# EAGLE design IntegratedSensor (EAGLE 6.3)
Menlo Park Innovation LLC Sensor Front End Electronics
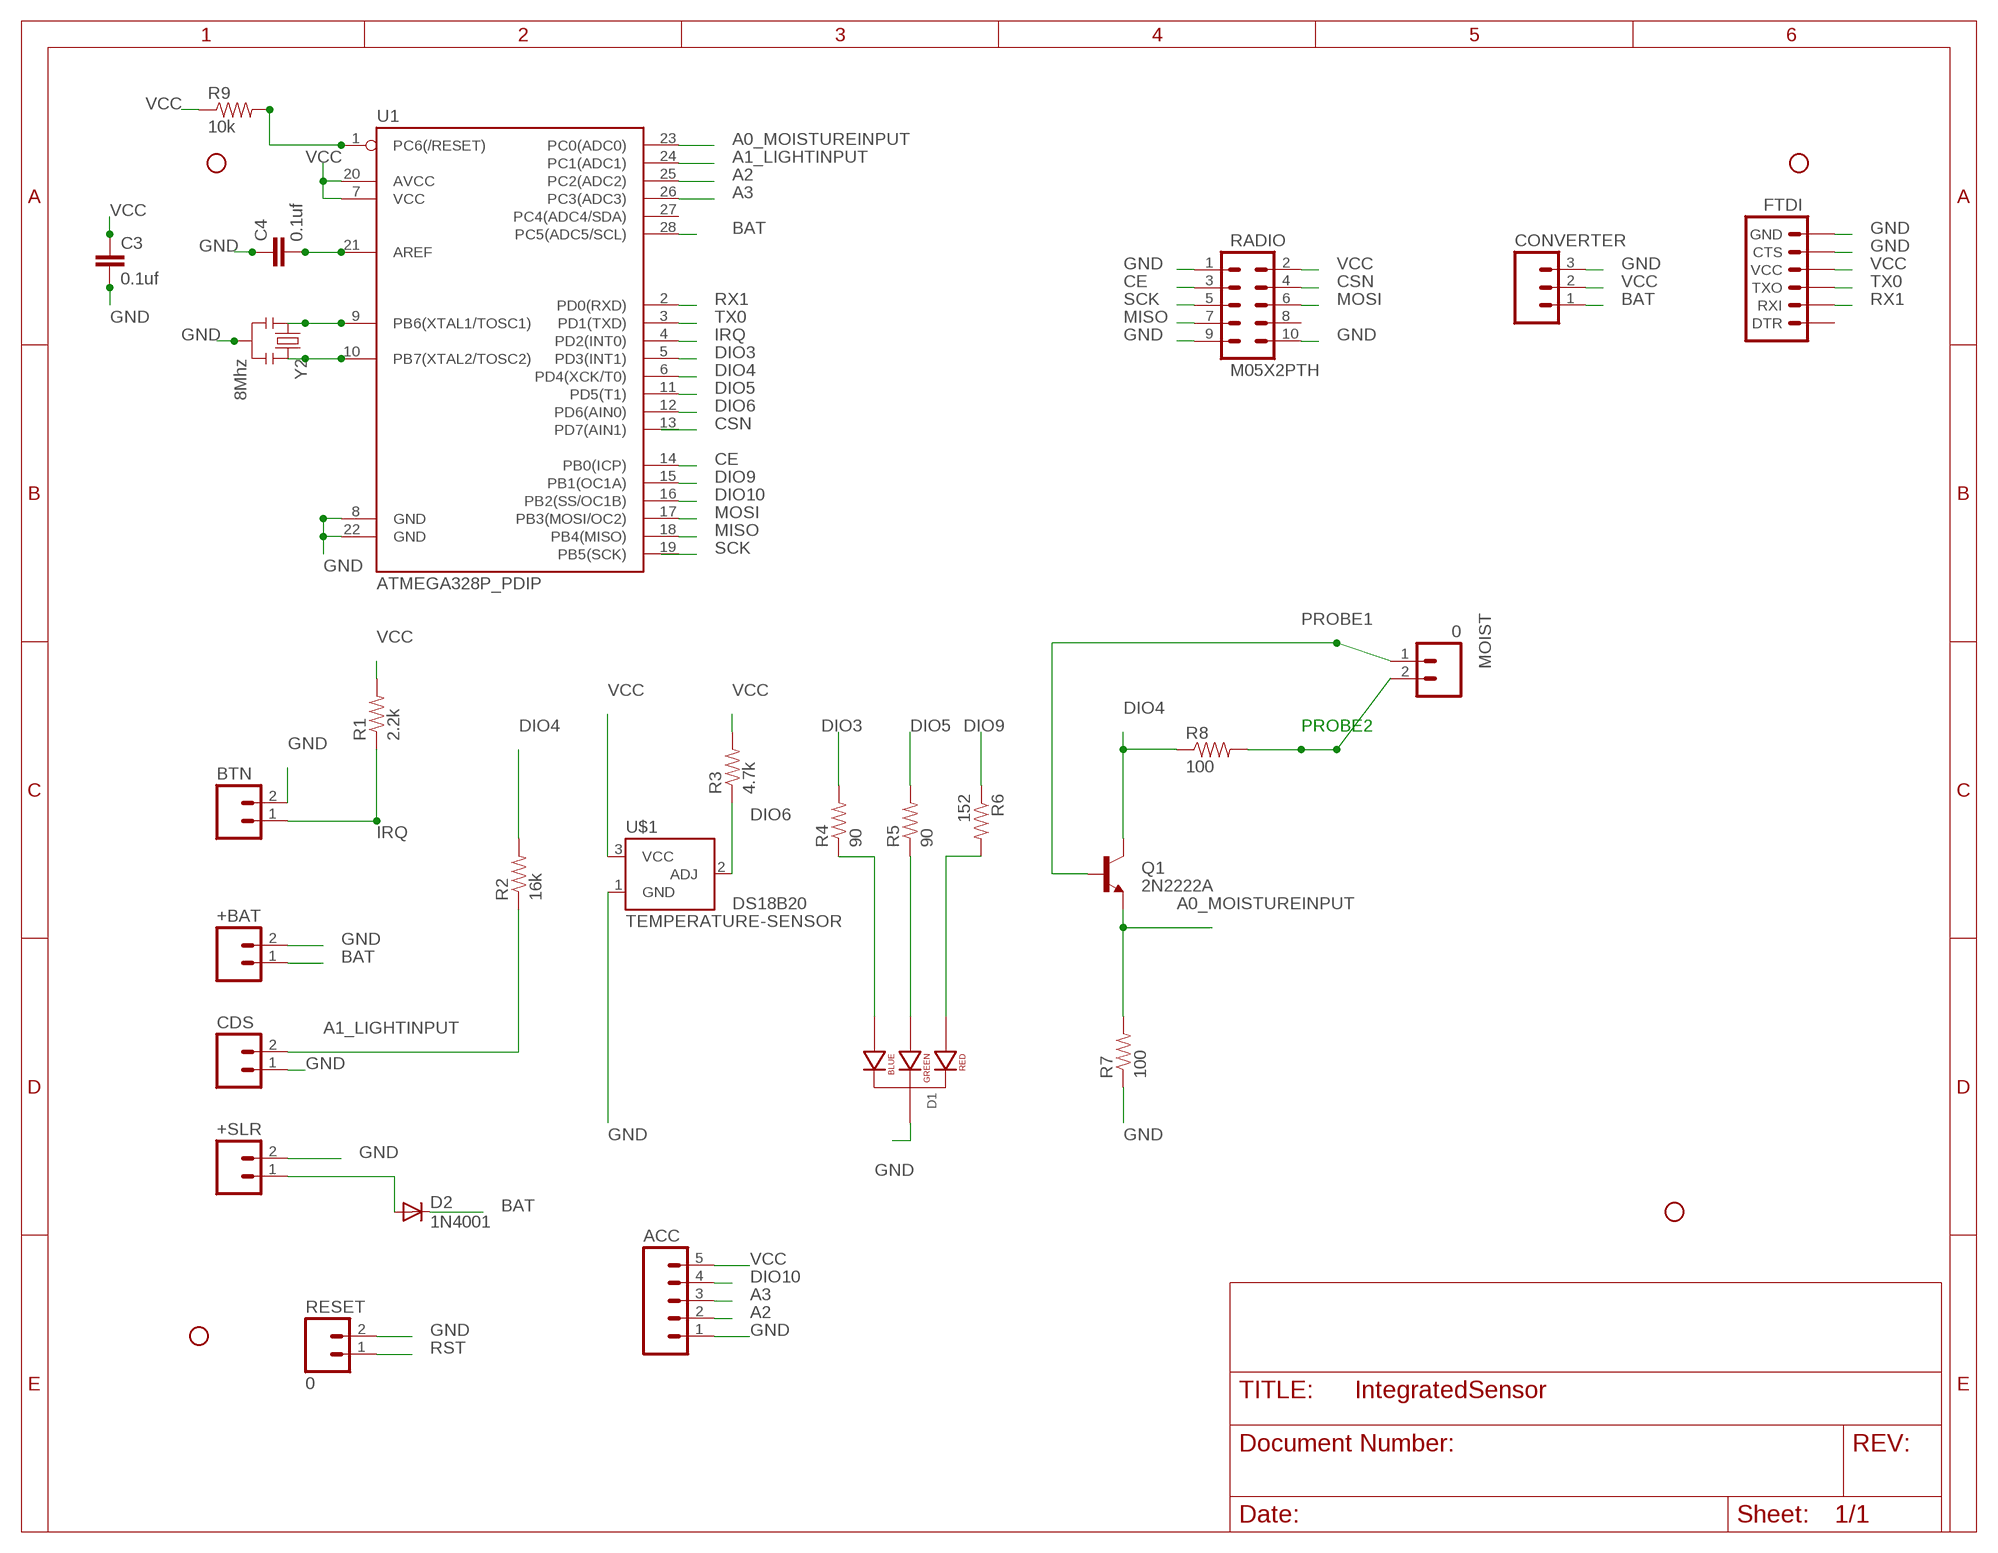
[diagram p0: schematic, sheet 1]

## Parts
+BAT  M02PTH  [1X02]
+SLR  M02PTH  [1X02]
ACC  M05PTH  [1X05]
BTN  M02PTH  [1X02]
C3  0.1uf  CAPPTH  [CAP-PTH-SMALL]
C4  0.1uf  CAPPTH  [CAP-PTH-SMALL]
CDS  M02PTH  [1X02]
CONVERTER  M03PTH  [1X03]
D1  LED-RGB-CC-THRUCLEAR  [LED-RGB-THRU]
D2  1N4001  DIODEPTH  [DIODE-1N4001]
FTDI  ARDUINO_SERIAL_PROGRAMPTH  [1X06]
MOIST  0  M02PTH  [1X02]
Q1  2N2222A  TRANSISTOR_NPNTO-92-AMMO  [TO-92-AMMO]
R1  2.2k  RESISTORPTH-1/6W  [1/6W-RES]
R2  16k  RESISTORPTH-1/6W  [1/6W-RES]
R3  4.7k  RESISTORPTH-1/6W  [1/6W-RES]
R4  90  RESISTORPTH-1/6W  [1/6W-RES]
R5  90  RESISTORPTH-1/6W  [1/6W-RES]
R6  152  RESISTORPTH-1/6W  [1/6W-RES]
R7  100  RESISTORPTH-1/6W  [1/6W-RES]
R8  100  RESISTORPTH-1/6W  [1/6W-RES]
R9  10k  RESISTORPTH-1/6W  [1/6W-RES]
RADIO  M05X2PTH  [AVR_ICSP]
RESET  0  M02PTH  [1X02]
STANDOFF1  STAND-OFF  [STAND-OFF]
STANDOFF2  STAND-OFF  [STAND-OFF]
STANDOFF3  STAND-OFF  [STAND-OFF]
STANDOFF4  STAND-OFF  [STAND-OFF]
U1  ATMEGA328P_PDIP  [DIL28-3]
U$1  TEMPERATURE-SENSOR  [TO-92]
Y2  8Mhz  RESONATORPTH  [RESONATOR-PTH]

## Nets
A0_MOISTUREINPUT: Q1.1(E) R7.2 U1.23(PC0(ADC0))
A1_LIGHTINPUT: CDS.2 R2.1 U1.24(PC1(ADC1))
A2: ACC.2 U1.25(PC2(ADC2))
A3: ACC.3 U1.26(PC3(ADC3))
BAT: +BAT.1 CONVERTER.1 D2.C U1.28(PC5(ADC5/SCL))
CE: RADIO.3 U1.14(PB0(ICP))
CSN: RADIO.4
DIO3: R4.2 U1.5(PD3(INT1))
DIO4: Q1.3(C) R2.2 R8.1 U1.6(PD4(XCK/T0))
DIO5: R5.2 U1.11(PD5(T1))
DIO6: R3.1 U1.12(PD6(AIN0)) U$1.2(ADJ)
DIO9: R6.1 U1.15(PB1(OC1A))
DIO10: ACC.4 U1.16(PB2(SS/OC1B))
GND: +BAT.2 +SLR.2 ACC.1 BTN.2 C3.2 C4.1 CDS.1 CONVERTER.3 D1.2(CATHODE) FTDI.5(CTS) FTDI.6(GND) R7.1 RADIO.1 RADIO.9 RADIO.10 RESET.2 U1.8(GND) U1.22(GND) U$1.1(GND) Y2.2
IRQ: BTN.1 R1.1 U1.4(PD2(INT0))
MISO: RADIO.7 U1.18(PB4(MISO))
MOSI: RADIO.6 U1.17(PB3(MOSI/OC2))
N$1: D1.4(BLUE_CATHODE) R4.1
N$2: D1.3(GREEN_CATHODE) R5.1
N$3: D1.1(RED_CATHODE) R6.2
N$4: +SLR.1 D2.A
N$5: U1.9(PB6(XTAL1/TOSC1)) Y2.1
N$6: U1.10(PB7(XTAL2/TOSC2)) Y2.3
N$7: R9.2 U1.1(PC6(/RESET))
N$8: C4.2 U1.21(AREF)
PROBE1: MOIST.1 Q1.2(B)
PROBE2: MOIST.2 R8.2
RST: RESET.1
RX1: FTDI.2(RXI) U1.2(PD0(RXD))
SCK: RADIO.5
TX0: FTDI.3(TXO) U1.3(PD1(TXD))
VCC: ACC.5 C3.1 CONVERTER.2 FTDI.4(VCC) R1.2 R3.2 R9.1 RADIO.2 U1.7(VCC) U1.20(AVCC) U$1.3(VCC)
Unconnected: FTDI.1(DTR) RADIO.8 U1.13(PD7(AIN1)) U1.19(PB5(SCK)) U1.27(PC4(ADC4/SDA))

## Library data of the parts
+BAT +SLR BTN CDS MOIST RESET = SparkFun-Connectors:M02: Header 2 Standard 2-pin 0.1" header. Use with straight break away headers (SKU : PRT-00116), right angle break away headers (PRT-00553), swiss pins (PRT-00743), machine pins (PRT-00117), and female headers (PRT-00115). Molex polarized connector foot print use with SKU : PRT-08233 with associated crimp pins and housings.
ACC = SparkFun-Connectors:M05: Header 5 Standard 5-pin 0.1" header. Use with straight break away headers (SKU : PRT-00116), right angle break away headers (PRT-00553), swiss pins (PRT-00743), machine pins (PRT-00117), and female headers (PRT-00115). Molex polarized connector foot print use with SKU : PRT-08230 with associated crimp pins and housings.
C3 C4 = SparkFun-Capacitors:CAP: Capacitor Standard 0603 ceramic capacitor, and 0.1" leaded capacitor.
CONVERTER = SparkFun-Connectors:M03: Header 3 Standard 3-pin 0.1" header. Use with straight break away headers (SKU : PRT-00116), right angle break away headers (PRT-00553), swiss pins (PRT-00743), machine pins (PRT-00117), and female headers (PRT-00115). Molex polarized connector foot print use with SKU : PRT-08232 with associated crimp pins and housings.
D1 = SparkFun-LED:LED-RGB-CC-THRU: RGB Through-hole common cathode LED SparkFun Storefront: COM-00105 (Clear) COM-09264 (Diffuse); PROD_ID: DIO-08418
D2 = SparkFun-DiscreteSemi:DIODE: Diode These are standard reverse protection diodes and small signal diodes. SMA package can handle up to about 1A. SOD-323 can handle about 200mA. What the SOD-323 package when ordering, there are some mfgs out there that are 5-pin packages.
FTDI = SparkFun-Connectors:ARDUINO_SERIAL_PROGRAM: FTDI connector footprints
Q1 = SparkFun-DiscreteSemi:TRANSISTOR_NPN: Generic NPN BJT. MMBT2222 is the common NPN we use. Double check against datasheet- not all devices are the same!
R1-R9 = SparkFun-Resistors:RESISTOR: Resistor Basic schematic elements and footprints for 0603, 1206, and PTH resistors.
RADIO = SparkFun-Connectors:M05X2: Header 5x2 Standard 10-pin dual row 0.1" header. Commonly used with AVR-ISP. Use with Spark Fun Electronics SKU: PRT-00778
STANDOFF1-STANDOFF4 = SparkFun-Electromechanical:STAND-OFF: #4 Stand Off This is the mechanical footprint for a #4 phillips button head screw. Use the keepout ring to avoid running the screw head into surrounding components. SKU : PRT-00447
U1 = SparkFun-DigitalIC:ATMEGA328P_PDIP: uC used in the Arduino 32kb flash, 1k EEPROM, 2k SRAM This is the through-hole version of this chip.
U$1 = SparkFun-Sensors:TEMPERATURE-SENSOR: TO-92 temp sensor; PARTNAME: DS18B20
Y2 = SparkFun-FreqCtrl:RESONATOR: Resonator Small SMD resonator. Used, eg, on the Arduino Pro/ Pro Mini boards. 8MHz- XTAL-08895 16MHz- XTAL-08900

## Board
MenloSensor1
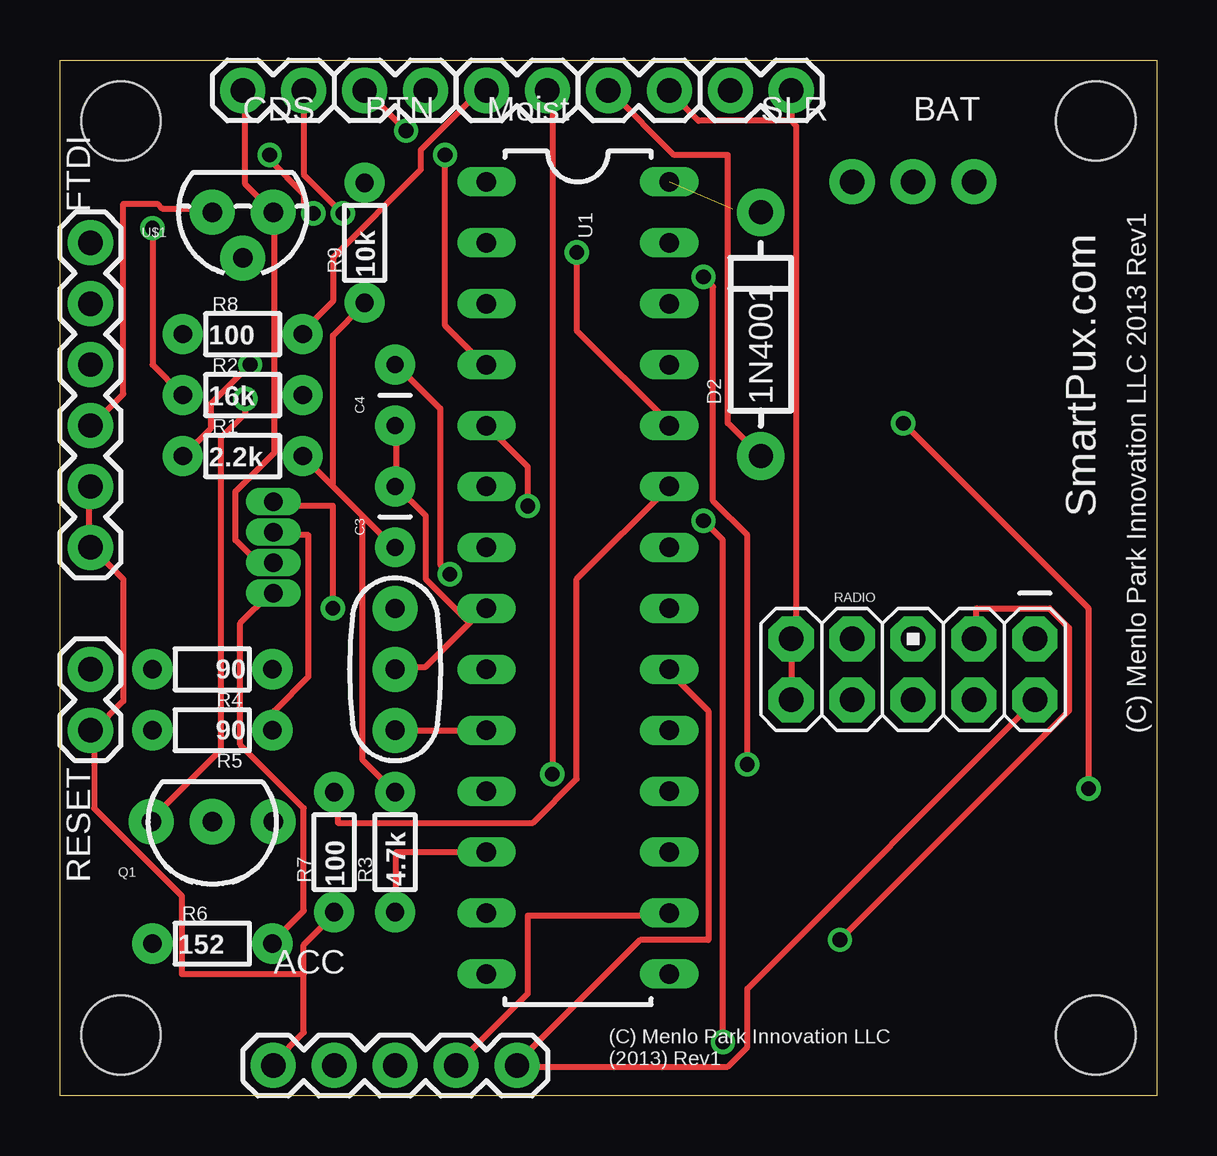
[diagram p1: board, top side]
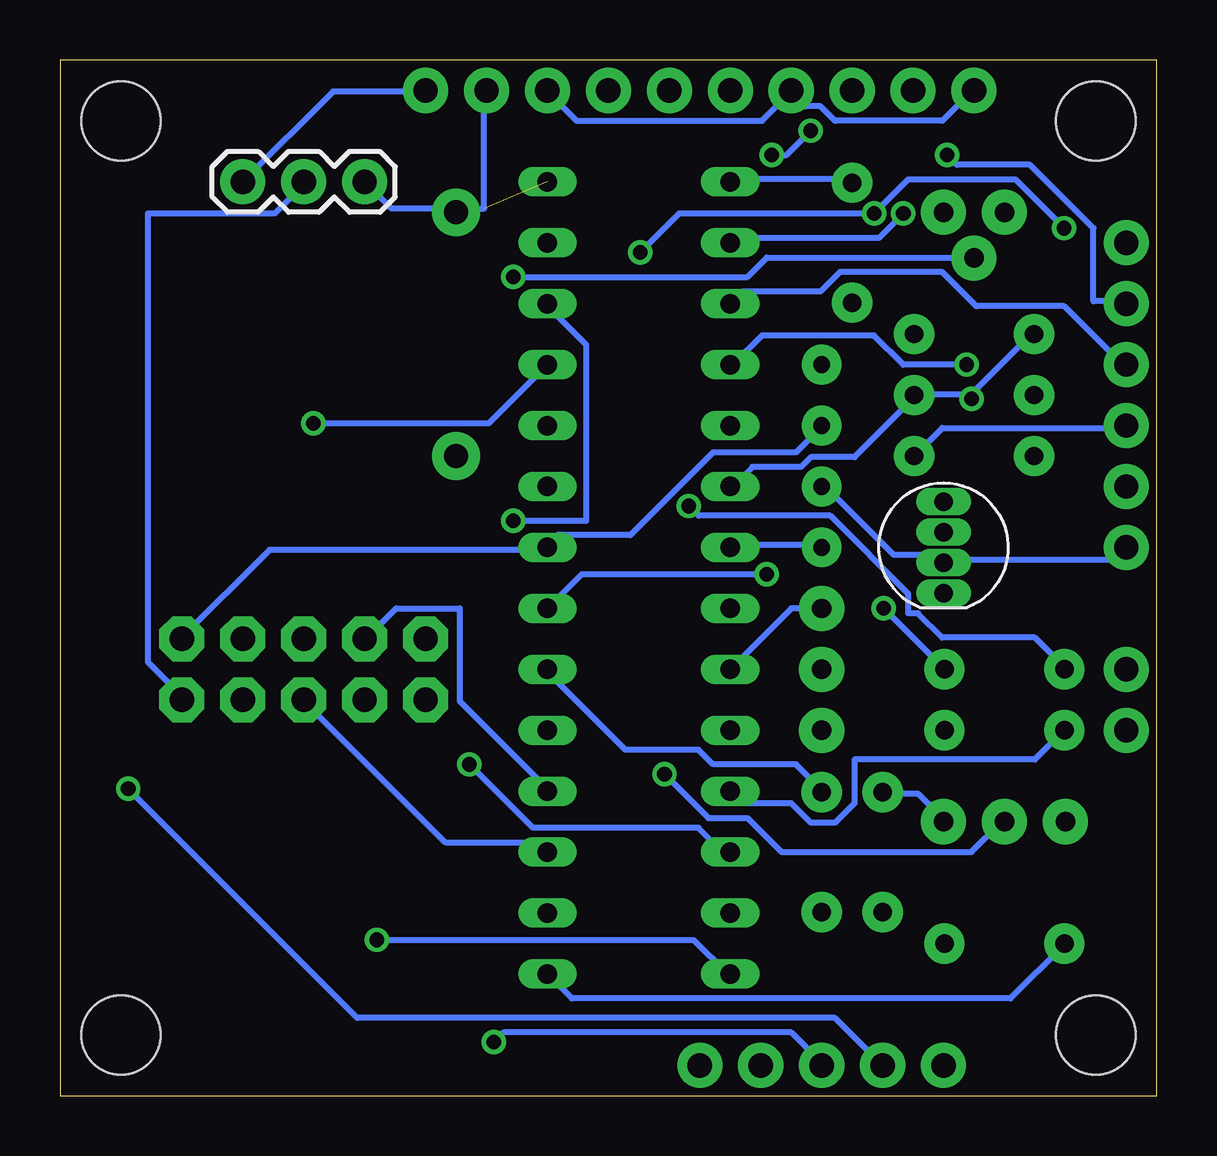
[diagram p2: board, bottom side, seen from below]

Size 45.72 x 43.18 mm. Coordinates in mm from the lower left corner, seen from the top.
Outline: 0,0 0,43.18 45.72,43.18 45.72,0 0,0
Copper layers (1*16): Top 0.035mm / dielectric 1.5mm / Bottom 0.035mm
Design rules "default *": minimum track width 10mil, minimum drill 24mil, track to track 8mil, track to pad 8mil, pad to pad 8mil, via to via 8mil, smd to smd 8mil, copper to edge 40mil, drill to drill 8mil, minimum pad ring 0mil, minimum via ring 8mil, stop-mask expansion 4mil, vias tented up to drill 0mil, thermal gap 10mil

### Footprints (pad centres in the part's own frame; a part is rotated, then mirrored left to right if it is on the bottom)
1X02 = drill 1.016 pad 1.88: 1 0,0; 2 2.54,0
1X05 = drill 1.016 pad 1.88: 1 0,0; 2 2.54,0; 3 5.08,0; 4 7.62,0; 5 10.16,0
CAP-PTH-SMALL = drill 0.7 pad 1.651: 1 0,0; 2 2.54,0
1X03 = drill 1.016 pad 1.88: 1 0,0; 2 2.54,0; 3 5.08,0
LED-RGB-THRU = drill 0.762 pad 0.889 long: 1 1.905,0; 2 0.635,0; 3 -0.635,0; 4 -1.905,0
DIODE-1N4001 = drill 1 pad 1.981: A -5.08,0; C 5.08,0
1X06 = drill 1.016 pad 1.88: 1 0,0; 2 2.54,0; 3 5.08,0; 4 7.62,0; 5 10.16,0; 6 12.7,0
TO-92-AMMO = drill 0.813 pad 1.88: 1 -2.54,0; 2 0,0; 3 2.54,0
1/6W-RES = drill 0.762 pad 1.676: 1 -2.5,0; 2 2.5,0
AVR_ICSP = drill 1.016 pad 1.88 octagon: 1 -1.27,5.08; 2 1.27,5.08; 3 -1.27,2.54; 4 1.27,2.54; 5 -1.27,0; 6 1.27,0; 7 -1.27,-2.54; 8 1.27,-2.54; 9 -1.27,-5.08; 10 1.27,-5.08
STAND-OFF = hole 3.302: 0,0
DIL28-3 = drill 0.813 long: 1 -16.51,-3.81; 2 -13.97,-3.81; 3 -11.43,-3.81; 4 -8.89,-3.81; 5 -6.35,-3.81; 6 -3.81,-3.81; 7 -1.27,-3.81; 8 1.27,-3.81; 9 3.81,-3.81; 10 6.35,-3.81; 11 8.89,-3.81; 12 11.43,-3.81; 13 13.97,-3.81; 14 16.51,-3.81; 15 16.51,3.81; 16 13.97,3.81; 17 11.43,3.81; 18 8.89,3.81; 19 6.35,3.81; 20 3.81,3.81; 21 1.27,3.81; 22 -1.27,3.81; 23 -3.81,3.81; 24 -6.35,3.81; 25 -8.89,3.81; 26 -11.43,3.81; 27 -13.97,3.81; 28 -16.51,3.81
TO-92 = drill 0.813 pad 1.88: 1 -1.27,0; 2 0,1.905; 3 1.27,0
RESONATOR-PTH = drill 0.8 pad 1.88: 1 -2.54,0; 2 0,0; 3 2.54,0

### Placement (x,y rotation side)
+BAT  27.94,41.91 0 top
+SLR  22.86,41.91 0 top
ACC  8.89,1.27 0 top
BTN  12.7,41.91 0 top
C3  13.97,22.86 90 top
C4  13.97,27.94 90 top
CDS  7.62,41.91 0 top
CONVERTER  33.02,38.1 180 bottom
D1  8.89,22.86 270 bottom
D2  29.21,31.75 90 top
FTDI  1.27,35.56 270 top
MOIST  20.32,41.91 180 top
Q1  6.35,11.43 180 top
R1  7.62,26.67 0 top
R2  7.62,29.21 0 top
R3  13.97,10.16 90 top
R4  6.35,17.78 180 top
R5  6.35,15.24 180 top
R6  6.35,6.35 0 top
R7  11.43,10.16 90 top
R8  7.62,31.75 0 top
R9  12.7,35.56 90 top
RADIO  35.56,17.78 270 top
RESET  1.27,17.78 270 top
STANDOFF1  43.18,40.64 0 top
STANDOFF2  2.54,40.64 0 top
STANDOFF3  2.54,2.54 0 top
STANDOFF4  43.18,2.54 0 top
U1  21.59,21.59 270 top
U$1  7.62,36.83 180 top
Y2  13.97,17.78 270 top

### Tracks (layer width: path | path; a pad name or v marks a point on that pad's centre or on a via)
A0_MOISTUREINPUT
  Top 0.254: U1.23 21.54,21.54 21.54,13.21 19.71,11.38 11.58,11.38 11.58,12.6 R7.2
  Bottom 0.254: Q1.1 8.94,11.58 9.96,12.6 11.38,12.6 R7.2
A1_LIGHTINPUT  (via drill 0.61)
  Top 0.254: v21.54,35.15 21.54,31.9 25.4,28.04 U1.24 | v11.79,36.78 10.16,38.41 CDS.2 | v3.86,36.17 3.86,30.48 5.08,29.26 R2.1
  Bottom 0.254: v21.54,35.15 19.91,36.78 v11.79,36.78 10.36,38.2 5.89,38.2 v3.86,36.17
A2  (via drill 0.61)
  Top 0.254: v35.15,28.04 42.88,20.32 v42.88,12.8
  Bottom 0.254: U1.25 27.84,28.04 v35.15,28.04 | v42.88,12.8 33.33,3.25 13.41,3.25 ACC.2
A3  (via drill 0.61)
  Top 0.254: v26.82,23.98 27.64,23.16 v27.64,2.23
  Bottom 0.254: v26.82,23.98 23.77,23.98 23.77,31.29 25.4,32.92 U1.26 | v27.64,2.23 27.23,2.64 15.24,2.64 14.02,1.42 ACC.3
BAT  (1 unrouted)
  Bottom 0.254: +BAT.1 28.04,41.86 28.04,36.98 29.06,36.98 D2.C 29.26,36.98 31.9,36.98 CONVERTER.1
CE  (via drill 0.61)
  Top 0.254: v32.51,6.5 42.06,16.05 42.06,19.51 41.25,20.32 38.2,20.32 38.2,19.1 RADIO.3
  Bottom 0.254: v32.51,6.5 19.3,6.5 17.88,5.08 U1.14
DIO3  (via drill 0.61)
  Top 0.254: U1.5 19.51,26.21 v19.51,24.59
  Bottom 0.254: v19.51,24.59 19.1,24.18 13.61,24.18 10.36,20.93 10.36,20.12 9.96,20.12 8.94,19.1 5.08,19.1 3.86,17.88 R4.2
DIO4  (via drill 0.61)
  Top 0.254: v7.72,29.06 7.72,28.45 6.71,27.43 6.71,14.43 3.86,11.58 Q1.3
  Bottom 0.254: U1.6 17.68,25.4 16.87,26.21 14.83,26.21 14.43,26.62 12.6,26.62 10.16,29.06 R2.2 9.96,29.26 7.72,29.26 | 7.72,29.26 5.28,31.7 R8.1 | 7.72,29.26 v7.72,29.06
DIO5
  Bottom 0.254: U1.11 17.27,12.19 15.24,12.19 14.43,11.38 13.41,11.38 12.6,12.19 12.6,14.02 5.08,14.02 3.86,15.24 R5.2
DIO6  (via drill 0.61)
  Top 0.254: U1.12 14.02,10.16 14.02,7.72 R3.1 | v26.82,34.14 27.23,33.73 27.23,24.79 28.65,23.37 v28.65,13.82
  Bottom 0.254: v26.82,34.14 17.07,34.14 16.26,34.95 7.72,34.95 U$1.2 | v28.65,13.82 26.01,11.18 19.1,11.18 18.09,10.16 U1.12
DIO9
  Bottom 0.254: U1.15 24.38,4.06 6.1,4.06 3.86,6.3 R6.1
DIO10
  Top 0.254: ACC.4 19.51,4.27 19.51,7.52 25.4,7.52 U1.16
GND
  Top 0.254: CDS.1 7.72,41.86 7.72,38 U$1.1 8.94,36.78 8.94,26.82 7.32,25.2 7.32,23.16 8.13,22.35 8.74,22.35 D1.2 | RADIO.10 RADIO.9 30.48,19.1 30.68,19.3 30.68,40.44 30.48,40.64 | 30.48,40.64 26.62,40.64 25.4,41.86 +SLR.2 | +BAT.2 30.48,40.64 | 10.16,5.08 10.16,2.64 8.94,1.42 ACC.1 | 10.16,5.08 10.16,6.3 11.38,7.52 R7.1 | 1.42,15.24 2.64,16.46 2.64,21.54 1.42,22.76 FTDI.6 1.22,22.96 1.22,25.4 FTDI.5 | 10.16,5.08 5.08,5.08 5.08,8.33 1.42,11.99 1.42,15.24 | 1.42,15.24 RESET.2 | 17.07,19.71 15.24,17.88 14.02,17.88 Y2.2 | 17.07,19.71 17.68,20.32 U1.8 | 17.07,19.71 15.24,21.54 15.24,24.18 14.02,25.4 | 14.02,25.4 14.02,27.84 C4.1 | 14.02,25.4 C3.2
  Bottom 0.254: 15.24,41.86 14.63,41.25 14.02,41.25 13.41,40.64 8.94,40.64 7.72,41.86 CDS.1 | CONVERTER.3 34.34,41.86 30.48,41.86 +BAT.2 | 15.24,41.86 16.46,40.64 24.18,40.64 25.4,41.86 +SLR.2 | 15.24,41.86 BTN.2 | C3.2 13.82,25.4 10.97,22.55 9.14,22.55 8.94,22.35 D1.2 8.74,22.35 1.83,22.35 1.42,22.76 FTDI.6 | C4.1 14.02,27.84 15.04,26.82 18.49,26.82 21.95,23.37 24.99,23.37 25.4,22.96 U1.22 25.4,22.76 36.98,22.76 40.64,19.1 RADIO.1
IRQ  (via drill 0.61)
  Top 0.254: v7.92,30.48 6.3,28.85 6.3,27.84 5.28,26.82 R1.1 | v14.43,40.23 12.8,41.86 BTN.1 | v16.05,39.22 16.05,32.11 17.68,30.48 U1.4
  Bottom 0.254: v7.92,30.48 10.57,30.48 11.79,31.7 16.46,31.7 17.68,30.48 U1.4 | v14.43,40.23 15.44,39.22 v16.05,39.22
MISO
  Bottom 0.254: U1.18 25.4,12.8 29.06,16.46 29.06,20.32 31.7,20.32 32.92,19.1 RADIO.7
MOSI
  Bottom 0.254: U1.17 25.81,10.57 29.67,10.57 35.56,16.46 RADIO.6
N$1  (via drill 0.61)
  Top 0.254: v11.38,20.32 11.38,24.59 8.94,24.59 D1.4
  Bottom 0.254: v11.38,20.32 8.94,17.88 R4.1
N$2
  Top 0.254: D1.3 8.94,23.37 10.36,23.37 10.36,17.48 8.94,16.05 8.94,15.24 R5.1
N$3
  Top 0.254: D1.1 8.74,20.93 7.52,19.71 7.52,14.63 10.16,11.99 10.16,7.72 8.94,6.5 R6.2
N$4
  Top 0.254: D2.A 27.84,28.04 27.84,39.22 25.6,39.22 22.96,41.86 +SLR.1
N$5
  Bottom 0.254: U1.9 15.24,20.32 Y2.1
N$6
  Top 0.254: Y2.3 U1.10
N$7
  Bottom 0.254: U1.1 17.68,38.2 12.8,38.2 R9.2
N$8  (via drill 0.61)
  Top 0.254: v16.26,21.74 15.85,22.15 15.85,28.65 14.02,30.48 C4.2
  Bottom 0.254: U1.21 23.98,21.74 v16.26,21.74
PROBE1  (via drill 0.61)
  Top 0.254: v20.52,13.41 20.52,41.66 20.32,41.86 MOIST.1
  Bottom 0.254: v20.52,13.41 18.69,11.58 17.07,11.58 15.65,10.16 7.72,10.16 6.5,11.38 Q1.2
PROBE2
  Top 0.254: R8.2 10.16,31.9 11.38,33.12 11.38,34.95 15.04,38.61 15.04,39.42 17.48,41.86 17.68,41.86 MOIST.2
RX1  (via drill 0.61)
  Top 0.254: v10.57,36.78 10.16,37.19 10.16,37.59 8.74,39.01 v8.74,39.22
  Bottom 0.254: v10.57,36.78 11.58,35.76 17.48,35.76 17.68,35.56 U1.2 | v8.74,39.22 8.33,38.81 5.28,38.81 2.64,36.17 2.64,33.12 1.42,33.12 FTDI.2
TX0
  Bottom 0.254: U1.3 17.27,33.53 14.02,33.53 13.21,34.34 8.94,34.34 7.52,32.92 3.86,32.92 1.42,30.48 FTDI.3
VCC
  Top 0.254: U1.20 25.4,17.68 27.03,16.05 27.03,6.5 24.18,6.5 19.1,1.42 ACC.5 19.1,1.22 27.84,1.22 28.65,2.03 28.65,4.47 40.64,16.46 RADIO.2 | 12.6,24.18 13.82,22.96 C3.1 | 12.6,24.18 11.38,25.4 | 11.38,25.4 10.16,26.62 R1.2 | 11.38,25.4 11.38,31.7 12.6,32.92 R9.1 | U$1.3 6.3,36.98 4.27,36.98 4.06,37.19 2.64,37.19 2.64,29.26 1.42,28.04 FTDI.4 | 12.6,24.18 12.6,14.02 13.82,12.8 R3.2
  Bottom 0.254: RADIO.2 40.64,16.66 42.06,18.09 42.06,36.78 36.78,36.78 35.56,38 CONVERTER.2 | U1.20 25.4,17.68 22.15,14.43 19.1,14.43 18.49,13.82 15.04,13.82 14.02,12.8 R3.2 | U1.7 17.68,22.96 14.02,22.96 C3.1 | FTDI.4 1.42,27.84 8.94,27.84 9.96,26.82 R1.2

### Text on the board
tPlace: CDS | BTN | Moist | SLR | BAT | FTDI | (C) Menlo Park Innovation LLC 2013 Rev1 | SmartPux.com | RESET | ACC | (C) Menlo Park Innovation LLC / (2013) Rev1